# EAGLE design GPS_radiologger_v20 (EAGLE 9.6.2)
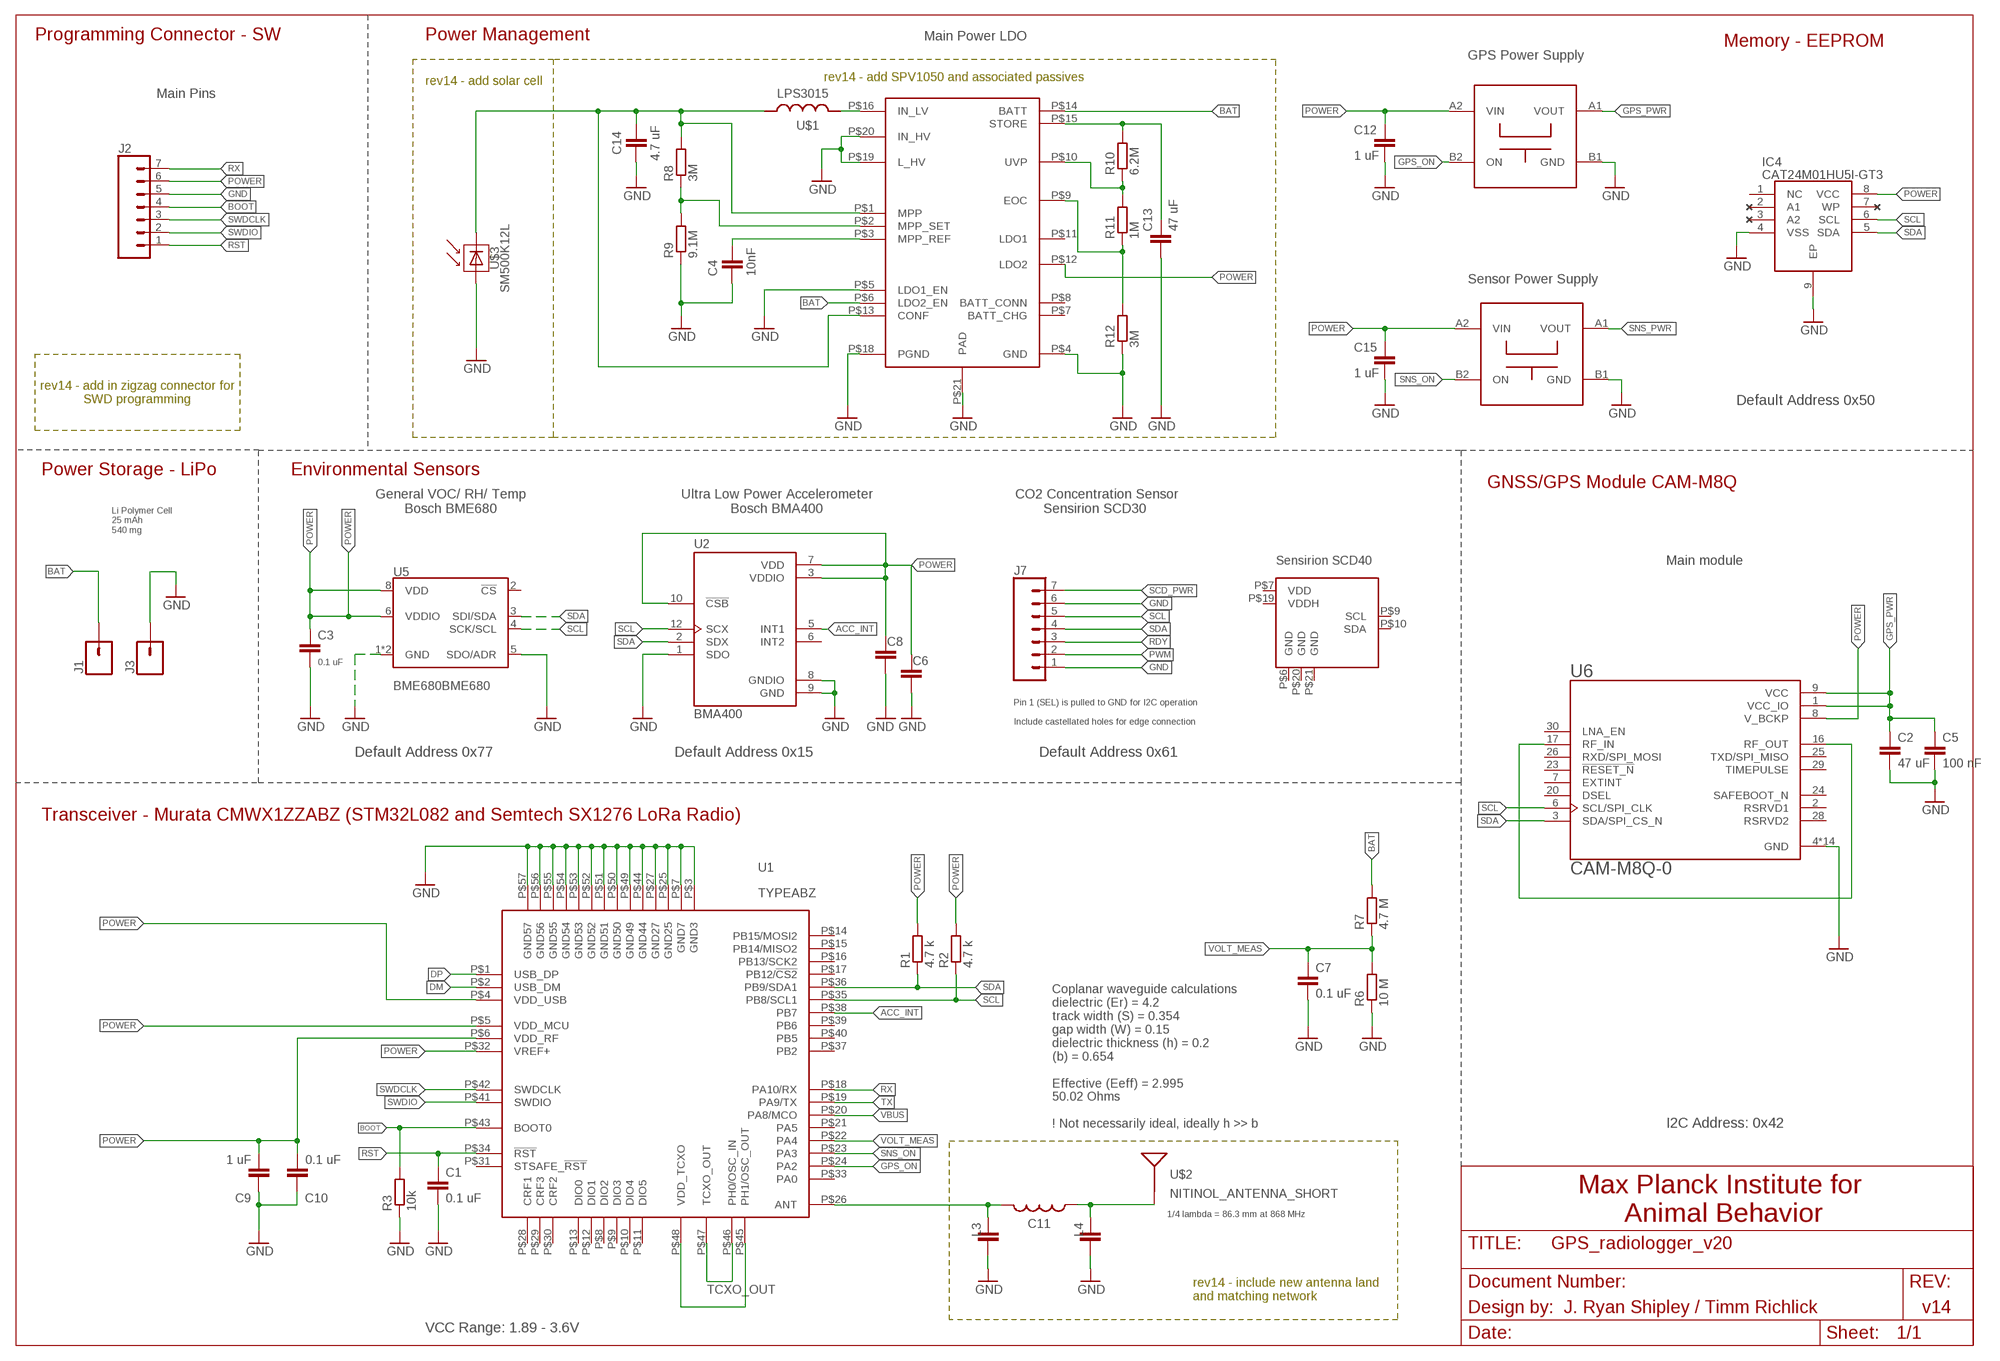
[diagram p0: schematic, sheet 1]

## Parts
C1  0.1 uF  C-EUC0201  [C0201]
C2  47 uF  C-EUC0201  [C0201]
C3  0.1 uF  C-EUC0201  [C0201]
C4  10nF  C-EUC0201  [C0201]
C5  100 nF  C-EUC0201  [C0201]
C6  C-EUC0201  [C0201]
C7  0.1 uF  C-EUC0201  [C0201]
C8  C-EUC0201  [C0201]
C9  1 uF  C-EUC0201  [C0201]
C10  0.1 uF  C-EUC0201  [C0201]
C11  0.1uF  L-USL0201  [L0201]
C12  1 uF  C-EUC0201  [C0201]
C13  47 uF  C-EUC0805K  [C0805K]
C14  4.7 uF  C-EUC0201  [C0201]
C15  1 uF  C-EUC0201  [C0201]
IC4  CAT24M01HU5I-GT3  [SON50P300X200X55-9N]
J1  CONN_01PTH_NO_SILK_YES_STOP  [1X01_NO_SILK]
J2  CONN_07NO_SILK  [1X07_NO_SILK]
J3  CONN_01PTH_NO_SILK_YES_STOP  [1X01_NO_SILK]
J7  CONN_07NO_SILK  [1X07_NO_SILK]
L3  C-EUC0201  [C0201]
L4  C-EUC0201  [C0201]
R1  4.7 k  R-EU_R0201  [R0201]
R2  4.7 k  R-EU_R0201  [R0201]
R3  10k  R-EU_R0201  [R0201]
R6  10 M  R-EU_R0201  [R0201]
R7  4.7 M  R-EU_R0201  [R0201]
R8  3M  R-EU_R0201  [R0201]
R9  9.1M  R-EU_R0201  [R0201]
R10  6.2M  R-EU_R0201  [R0201]
R11  1M  R-EU_R0201  [R0201]
R12  3M  R-EU_R0201  [R0201]
U1  TYPEABZ  [TYPEABZ]
U2  BMA400  [XDCR_BMA400]
U4  SPV1050  [SPV1050]
U5  BME680BME680  [LGA3.0X3.0]
U6  CAM-M8Q-0  [LCC100P960X1400X210-31N]
U$1  LPS3015  [LPS_3015]
U$2  NITINOL_ANTENNA_SHORT  [ICARUS_NITINOL_ANTENNA_SHORT]
U$3  SM500K12L  [SM500K12L]
U$4  TPS22916CL  [YFP0004-DSBGA]
U$5  TPS22916CL  [YFP0004-DSBGA]
U$6  SCD40  [SCD40_LGA]

## Nets
ACC_INT: U1.P$38(PB7) U2.5(INT1)
BAT [battery]: J1.1 R7.2 U4.P$6(LDO2_EN) U4.P$14(BATT)
BOOT: J2.4 R3.2 U1.P$43(BOOT0)
DM: U1.P$2(USB_DM)
DP: U1.P$1(USB_DP)
GND: C1.2 C2.2 C3.2 C4.2 C5.2 C6.2 C7.2 C8.2 C9.1 C10.1 C12.2 C13.2 C14.2 C15.2 IC4.4(VSS) IC4.9(EP) J2.5 J3.1 J7.1 J7.6 L3.2 L4.2 R3.1 R6.1 R9.1 R12.1 U1.P$3(GND3) U1.P$7(GND7) U1.P$25(GND25) U1.P$27(GND27) U1.P$44(GND44) U1.P$49(GND49) U1.P$50(GND50) U1.P$51(GND51) U1.P$52(GND52) U1.P$53(GND53) U1.P$54(GND54) U1.P$55(GND55) U1.P$56(GND56) U1.P$57(GND57) U2.1(SDO) U2.8(GNDIO) U2.9(GND) U4.P$4(GND) U4.P$5(LDO1_EN) U4.P$18(PGND) U4.P$19(L_HV) U4.P$20(IN_HV) U4.P$21(PAD) U5.1(GND) U5.5(SDO/ADR) U5.7(GND) U6.4(GND) U6.5(GND) U6.10(GND) U6.11(GND) U6.12(GND) U6.13(GND) U6.14(GND) U6.15(GND) U6.18(GND) U6.19(GND) U6.21(GND) U6.22(GND) U6.27(GND) U6.31(GND) U$3.P$2(MINUS) U$4.B1(GND) U$5.B1(GND)
GPS_ON: U1.P$24(PA2) U$4.B2(ON)
GPS_PWR: C2.1 C5.1 U6.1(VCC_IO) U6.9(VCC) U$4.A1(VOUT)
N$1: U1.P$45(PH1/OSC_OUT) U1.P$48(VDD_TCXO)
N$2 [antenna]: C11.2 L3.1 U1.P$26(ANT)
N$4: U4.P$16(IN_LV) U$1.P$2
N$6: R8.1 R9.2 U4.P$2(MPP_SET)
N$7 [battery]: C14.1 R8.2 U4.P$1(MPP) U4.P$13(CONF) U$1.P$1 U$3.P$1(PLUS)
N$8: R10.1 R11.2 U4.P$10(UVP)
N$9: R11.1 R12.2 U4.P$9(EOC)
N$11 [antenna]: C11.1 L4.1 U$2.1(SIGNAL) U$2.2(SIGNAL) U$2.3(SIGNAL)
N$12: C13.1 R10.2 U4.P$15(STORE)
N$13: C4.1 U4.P$3(MPP_REF)
N$16: U6.16(RF_OUT) U6.17(RF_IN)
POWER [power]: C3.1 C6.1 C8.1 C9.2 C10.2 C12.1 C15.1 IC4.8(VCC) J2.6 R1.2 R2.2 U1.P$4(VDD_USB) U1.P$5(VDD_MCU) U1.P$6(VDD_RF) U1.P$32(VREF+) U2.3(VDDIO) U2.7(VDD) U2.10(!CSB) U4.P$12(LDO2) U5.6(VDDIO) U5.8(VDD) U6.8(V_BCKP) U$4.A2(VIN) U$5.A2(VIN)
PWM: J7.2
RDY: J7.3
RST: C1.1 J2.1 U1.P$34(!RST)
RX: J2.7 U1.P$18(PA10/RX)
SCD_PWR: J7.7
SCL: IC4.6(SCL) J7.5 R2.1 U1.P$35(PB8/SCL1) U2.12(SCX) U5.4(SCK/SCL) U6.6(SCL/SPI_CLK)
SDA: IC4.5(SDA) J7.4 R1.1 U1.P$36(PB9/SDA1) U2.2(SDX) U5.3(SDI/SDA) U6.3(SDA/SPI_CS_N)
SNS_ON: U1.P$23(PA3) U$5.B2(ON)
SNS_PWR: U$5.A1(VOUT)
SWDCLK: J2.3 U1.P$42(SWDCLK)
SWDIO: J2.2 U1.P$41(SWDIO)
TCXO_OUT: U1.P$46(PH0/OSC_IN) U1.P$47(TCXO_OUT)
TX: U1.P$19(PA9/TX)
VBUS: U1.P$20(PA8/MCO)
VOLT_MEAS: C7.1 R6.2 R7.1 U1.P$22(PA4)
Unconnected: IC4.1(NC) IC4.2(A1) IC4.3(A2) IC4.7(WP) U1.P$8(DIO2) U1.P$9(DIO3) U1.P$10(DIO4) U1.P$11(DIO5) U1.P$12(DIO1) U1.P$13(DIO0) U1.P$14(PB15/MOSI2) U1.P$15(PB14/MISO2) U1.P$16(PB13/SCK2) U1.P$17(PB12/!CS2) U1.P$21(PA5) U1.P$28(CRF1) U1.P$29(CRF3) U1.P$30(CRF2) U1.P$31(STSAFE_!RST) U1.P$33(PA0) U1.P$37(PB2) U1.P$39(PB6) U1.P$40(PB5) U2.6(INT2) U4.P$7(BATT_CHG) U4.P$8(BATT_CONN) U4.P$11(LDO1) U5.2(!CS) U6.2(RSRVD1) U6.7(EXTINT) U6.20(DSEL) U6.23(!RESET_N) U6.24(SAFEBOOT_N) U6.25(TXD/SPI_MISO) U6.26(RXD/SPI_MOSI) U6.28(RSRVD2) U6.29(TIMEPULSE) U6.30(LNA_EN) U$6.P$6(GND) U$6.P$7(VDD) U$6.P$9(SCL) U$6.P$10(SDA) U$6.P$19(VDDH) U$6.P$20(GND) U$6.P$21(GND)

## Notes on the sheet
- Programming Connector - SW | Power Management | Main Power LDO
- Memory - EEPROM
- GPS Power Supply
- rev14 - add SPV1050 and associated passives
- rev14 - add solar cell
- Main Pins
- Sensor Power Supply
- rev14 - add in zigzag connector for
  SWD programming
- Default Address 0x50
- Power Storage - LiPo | Environmental Sensors
- GNSS/GPS Module CAM-M8Q
- General VOC/ RH/ Temp
  Bosch BME680
- Ultra Low Power Accelerometer
  Bosch BMA400
- CO2 Concentration Sensor
  Sensirion SCD30
- Li Polymer Cell
  25 mAh
  540 mg
- Main module
- Pin 1 (SEL) is pulled to GND for I2C operation
- Include castellated holes for edge connection
- Default Address 0x77 | Default Address 0x15 | Default Address 0x61
- Transceiver - Murata CMWX1ZZABZ (STM32L082 and Semtech SX1276 LoRa Radio)
- Coplanar waveguide calculations
  dielectric (Er) = 4.2
  track width (S) = 0.354
  gap width (W) = 0.15
  dielectric thickness (h) = 0.2
  (b) = 0.654
  
  Effective (Eeff) = 2.995
  50.02 Ohms
  
  ! Not necessarily ideal, ideally h >> b
- I2C Address: 0x42
- Max Planck Institute for 
  Animal Behavior
- 1/4 lambda = 86.3 mm at 868 MHz
- rev14 - include new antenna land
  and matching network
- Design by: | J. Ryan Shipley / Timm Richlick | v14
- VCC Range: 1.89 - 3.6V

## Library data of the parts
C1-C10 C12-C15 L3 L4 = rcl:C-EU: CAPACITOR, European symbol; SPICEPREFIX: C
C11 = rcl:L-US: INDUCTOR, American symbol; SPICEPREFIX: L
IC4 = CAT24M01HU5I-GT3-CorrectedV2:CAT24M01HU5I-GT3: EEPROM 1MB I2C SERIAL EEPROM Source: Datasheet <http://www.onsemi.com/pub/Collateral/CAT24M01-D.PDF>; ALLIED_NUMBER: 70300250; ALLIED_PRICE-STOCK: http://www.alliedelec.com/on-semiconductor-cat24m01hu5i-gt3/70300250/; DESCRIPTION: EEPROM 1MB I2C SERIAL EEPROM; HEIGHT: 0.55mm; MANUFACTURER_NAME: ON Semiconductor; MANUFACTURER_PART_NUMBER: CAT24M01HU5I-GT3; MOUSER_PART_NUMBER: 863-CAT24M01HU5I-GT3; MOUSER_PRICE-STOCK: https://www.mouser.com/Search/Refine.aspx?Keyword=863-CAT24M01HU5I-GT3; RS_PART_NUMBER: 7814831P; RS_PRICE-STOCK: http://uk.rs-online.com/web/p/products/7814831P
J1 J3 = SparkFun-Connectors:CONN_01: Single connection point. Often used as Generic Header-pin footprint for 0.1 inch spaced/style header connections On any of the 0.1 inch spaced packages, you can populate with these: Break Away Headers - Straight <https://www.sparkfun.com/products/116> (PRT-00116) Break Away Male Headers - Right Angle <https://www.sparkfun.com/products/553> (PRT-00553) Female Headers <https://www.sparkfun.com/products/115> (PRT-00115) Break Away Headers - Machine Pin <https://www.sparkfun.com/products/117> (PRT-00117) Break Away Female Headers - Swiss Machine Pin <https://www.sparkfun.com/products/743> (PRT-00743) This device is also useful as a general connection point to wire up your design to another part of your project. Our various solder wires solder well into these plated through hole pads. Hook-Up Wire - Assortment (Stranded, 22 AWG) <https://www.sparkfun.com/products/11375> (PRT-11375) Hook-Up Wire - Assortment (Solid Core, 22 AWG) <https://www.sparkfun.com/products/11367> (PRT-11367) View the entire wire category on our website here <https://www.sparkfun.com/categories/141> Special notes: SMTSO-256-ET is a "flush mount" nut for a 4-40 screw. We mostly use this on specialty testbeds; it is a nice way to connect hardware to your PCB at an adjustable hieght. Also note, the SNAP packages are for using a snappable style connector. We sell a baggie of snaps and they are also used on two LilyPad designs: Snap Assortment - 30 pack (male and female) <https://www.sparkfun.com/products/11347> (DEV-11347) LilyPad Arduino SimpleSnap <https://www.sparkfun.com/products/10941> (DEV-10941) LilyPad SimpleSnap Protoboard <https://www.sparkfun.com/products/10940> (DEV-10940)
J2 J7 = SparkFun-Connectors:CONN_07: Multi connection point. Often used as Generic Header-pin footprint for 0.1 inch spaced/style header connections On any of the 0.1 inch spaced packages, you can populate with these: Break Away Headers - Straight <https://www.sparkfun.com/products/116> (PRT-00116) Break Away Male Headers - Right Angle <https://www.sparkfun.com/products/553> (PRT-00553) Female Headers <https://www.sparkfun.com/products/115> (PRT-00115) Break Away Headers - Machine Pin <https://www.sparkfun.com/products/117> (PRT-00117) Break Away Female Headers - Swiss Machine Pin <https://www.sparkfun.com/products/743> (PRT-00743) For SCREWTERMINALS and SPRING TERMINALS visit here: Screw Terimnals on SparkFun.com <https://www.sparkfun.com/search/results?term=Screw+Terminals> (5mm/3.5mm/2.54mm spacing) This device is also useful as a general connection point to wire up your design to another part of your project. Our various solder wires solder well into these plated through hole pads. Hook-Up Wire - Assortment (Stranded, 22 AWG) <https://www.sparkfun.com/products/11375> (PRT-11375) Hook-Up Wire - Assortment (Solid Core, 22 AWG) <https://www.sparkfun.com/products/11367> (PRT-11367) View the entire wire category on our website here <https://www.sparkfun.com/categories/141> Special notes: Molex polarized connector foot print use with SKU : PRT-08231 with associated crimp pins and housings. 1MM SMD Version SKU: PRT-10208 NOTES ON THE VARIANTS LOCK and LOCK_LONGPADS... This footprint was designed to help hold the alignment of a through-hole component (i.e. 6-pin header) while soldering it into place. You may notice that each hole has been shifted either up or down by 0.005 of an inch from it's more standard position (which is a perfectly straight line). This slight alteration caused the pins (the squares in the middle) to touch the edges of the holes. Because they are alternating, it causes a "brace" to hold the component in place. 0.005 has proven to be the perfect amount of "off-center" position when using our standard breakaway headers. Although looks a little odd when you look at the bare footprint, once you have a header in there, the alteration is very hard to notice. Also,if you push a header all the way into place, it is covered up entirely on the bottom side.
R1-R3 R6-R12 = rcl:R-EU_: RESISTOR, European symbol; SPICEPREFIX: R
U1 = Kris:TYPEABZ: CMWX1ZZABZ-078
U2 = BMA400:BMA400: Ultra low power, 12-bit digital triaxial accelerometer; AVAILABILITY: Unavailable; DESCRIPTION: Accelerometer X, Y, Z Axis ±2g, 4g, 8g, 16g 12-LGA (2x2); MF: Bosch Sensortec; MP: BMA400; PACKAGE: LGA-12 Bosch Tools; PRICE: None
U4 = STM-SPV1050_V2:SPV1050
U5 = SparkFun-Sensors:BME680: Bosch BME680 – Combined Humidity and Pressure Sensor The BME680 is as combined digital humidity, pressure and temperature sensor based on proven sensing principles. The sensor module is housed in an extremely compact metal-lid LGA package with a footprint of only 3.0×3.0mm with a height of 0.93mm. Its small dimensions and its low power consumption allow the implementation in battery driven devices such as handsets, GPS modules or watches.; PROD_ID: IC-14656
U6 = CAM-M8Q-0:CAM-M8Q-0: u-blox M8 GNSS Antenna Module*Flash*TCXO; AVAILABILITY: Unavailable; DESCRIPTION: CAM-M8 RF Receiver BeiDou, GLONASS, GNSS, GPS 1.575GHz -167dBm On-Board, Chip Module; MF: U-Blox America; MP: CAM-M8Q-0; PACKAGE: SMD-31 u-blox; PRICE: None
U$1 = coilcraft_custom:LPS3015
U$2 = Antenna_mounts:NITINOL_ANTENNA_SHORT
U$3 = AnySolar:SM500K12L
U$4 U$5 = TPS22916:TPS22916CL
U$6 = Sensirion:SCD40

## Net classes
1 power: width 0.305 mm
2 antenna: width 0.356 mm, clearance 0.178 mm
3 battery: width 0.254 mm

## Board
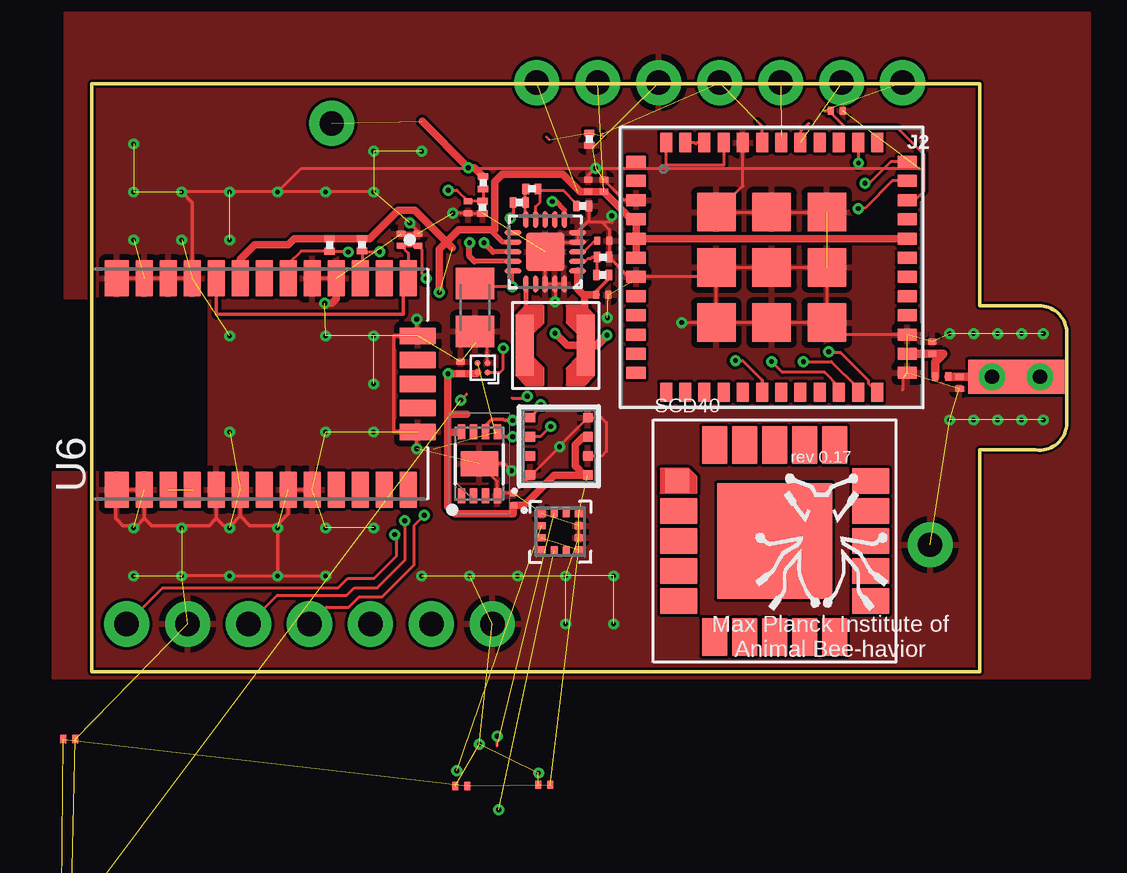
[diagram p1: board, top side]
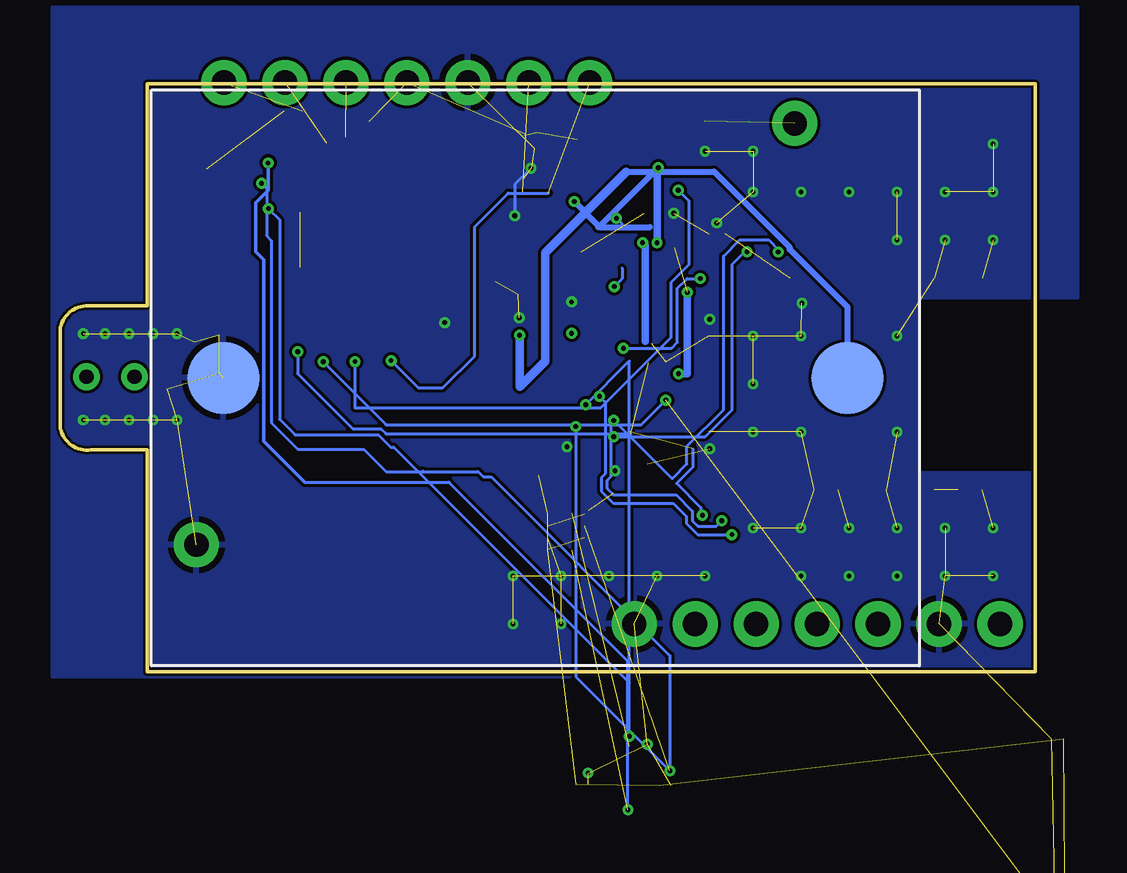
[diagram p2: board, bottom side, seen from below]

Size 40.62 x 24.5 mm. Coordinates in mm from the lower left corner, seen from the top.
Outline: 39.35,9.25 37,9.25 37,0 0,0 0,24.5 37,24.5 37,15.25 39.35,15.25 arc-90 40.62,14.25 40.62,10.25 arc-90 39.35,9.25
Copper layers (1*16): Top 0.035mm / dielectric 0.2mm / Bottom 0.035mm
Design rules "default *": minimum track width 5mil, minimum drill 0.2mm, track to track 5mil, track to pad 5mil, pad to pad 5mil, via to via 5mil, smd to smd 5mil, copper to edge 4mil, drill to drill 4mil, minimum pad ring 10mil, minimum via ring 5mil, stop-mask expansion 0mil, vias tented up to drill 12mil, thermal gap 10mil

### Footprints (pad centres in the part's own frame; a part is rotated, then mirrored left to right if it is on the bottom)
C0201 = smd 0.25 x 0.35: 1 -0.25,0; 2 0.25,0
L0201 = smd 0.25 x 0.35: 1 -0.275,0; 2 0.275,0
C0805K = smd 1.3 x 1.6: 1 -1,0; 2 1,0
SON50P300X200X55-9N = smd 0.63 x 0.32: 1 -1.33,0.75; 2 -1.33,0.25; 3 -1.33,-0.25; 4 -1.33,-0.75; 5 1.33,-0.75; 6 1.33,-0.25; 7 1.33,0.25; 8 1.33,0.75 | smd 1.06 x 1.56: 9 0,0
1X01_NO_SILK = drill 1.016 pad 1.88: 1 0,0
1X07_NO_SILK = drill 1.016 pad 1.88: 1 0,0; 2 2.54,0; 3 5.08,0; 4 7.62,0; 5 10.16,0; 6 12.7,0; 7 15.24,0
R0201 = smd 0.28 x 0.43: 1 -0.255,0; 2 0.255,0
TYPEABZ = smd 0.8 x 0.5: P$1 -5.65,4.4; P$2 -5.65,3.6; P$3 -5.65,2.8; P$4 -5.65,2; P$5 -5.65,1.2; P$6 -5.65,0.4; P$7 -5.65,-0.4; P$8 -5.65,-1.2; P$9 -5.65,-2; P$10 -5.65,-2.8; P$11 -5.65,-3.6; P$12 -5.65,-4.4; P$25 5.65,-4.4; P$26 5.65,-3.6; P$27 5.65,-2.8; P$28 5.65,-2; P$29 5.65,-1.2; P$30 5.65,-0.4; P$31 5.65,0.4; P$32 5.65,1.2; P$33 5.65,2; P$34 5.65,2.8; P$35 5.65,3.6; P$36 5.65,4.4 | smd 0.5 x 0.8: P$13 -4.4,-5.2; P$14 -3.6,-5.2; P$15 -2.8,-5.2; P$16 -2,-5.2; P$17 -1.2,-5.2; P$18 -0.4,-5.2; P$19 0.4,-5.2; P$20 1.2,-5.2; P$21 2,-5.2; P$22 2.8,-5.2; P$23 3.6,-5.2; P$24 4.4,-5.2; P$37 4.4,5.2; P$38 3.6,5.2; P$39 2.8,5.2; P$40 2,5.2; P$41 1.2,5.2; P$42 0.4,5.2; P$43 -0.4,5.2; P$44 -1.2,5.2; P$45 -2,5.2; P$46 -2.8,5.2; P$47 -3.6,5.2; P$48 -4.4,5.2 | smd 1.6 x 1.6: P$49 -2.3,2.3; P$50 0,2.3; P$51 2.3,2.3; P$52 -2.3,0; P$53 0,0; P$54 2.3,0; P$55 -2.3,-2.3; P$56 0,-2.3; P$57 2.3,-2.3
XDCR_BMA400 = smd 0.35 x 0.3: 1 -0.775,0.75; 2 -0.775,0.25; 3 -0.775,-0.25; 4 -0.775,-0.75; 7 0.775,-0.75; 8 0.775,-0.25; 9 0.775,0.25; 10 0.775,0.75 | smd 0.3 x 0.35: 5 -0.25,-0.775; 6 0.25,-0.775; 11 0.25,0.775; 12 -0.25,0.775
SPV1050 = smd 0.7 x 0.2: P$1 -1.35,0.8; P$2 -1.35,0.4; P$3 -1.35,0; P$4 -1.35,-0.4; P$5 -1.35,-0.8; P$11 1.35,-0.8; P$12 1.35,-0.4; P$13 1.35,0; P$14 1.35,0.4; P$15 1.35,0.8 | smd 0.2 x 0.7: P$6 -0.8,-1.35; P$7 -0.4,-1.35; P$8 0,-1.35; P$9 0.4,-1.35; P$10 0.8,-1.35; P$16 0.8,1.35; P$17 0.4,1.35; P$18 0,1.35; P$19 -0.4,1.35; P$20 -0.8,1.35 | smd 1.6 x 1.6: P$21 0,0
LGA3.0X3.0 = smd 0.4 x 0.4: 1 1.2,1.2; 2 1.2,0.4; 3 1.2,-0.4; 4 1.2,-1.2; 5 -1.2,-1.2; 6 -1.2,-0.4; 7 -1.2,0.4; 8 -1.2,1.2
LCC100P960X1400X210-31N = smd 1.5 x 0.7: 1 4.4,-6.2; 2 4.4,-5.2; 3 4.4,-4.2; 4 4.4,-3.2; 5 4.4,-2.2; 6 4.4,-1.2; 7 4.4,-0.2; 8 4.4,0.8; 9 4.4,1.8; 10 4.4,2.8; 11 4.4,3.8; 12 4.4,4.8; 15 -4.4,4.8; 16 -4.4,3.8; 17 -4.4,2.8; 18 -4.4,1.8; 19 -4.4,0.8; 20 -4.4,-0.2; 21 -4.4,-1.2; 22 -4.4,-2.2; 23 -4.4,-3.2; 24 -4.4,-4.2; 25 -4.4,-5.2; 26 -4.4,-6.2 | smd 1.5 x 1: 13 4.4,5.95; 14 -4.4,5.95 | smd 0.7 x 1.5: 27 -2,-6.6; 28 -1,-6.6; 29 0,-6.6; 30 1,-6.6; 31 2,-6.6
LPS_3015 = smd 0.75 x 2.54: P$1 -1.3,0; P$2 1.25,0
ICARUS_NITINOL_ANTENNA_SHORT = smd 4 x 1.4: 1 0,0 | drill 0.6: 2 -1,0; 3 1,0
SM500K12L = smd 3 x 3: P$1 0,13; P$2 0,-13
YFP0004-DSBGA = smd 0.25 x 0.25: A1 0.2,-0.2; A2 -0.2,-0.2; B1 0.2,0.2; B2 -0.2,0.2
SCD40_LGA = smd 1 x 1: P$1 -4.05,2.5 | smd 1.55 x 1.05: P$2 -4,1.25; P$3 -4,0; P$4 -4,-1.25; P$5 -4,-2.5; P$11 4,-2.5; P$12 4,-1.25; P$13 4,0; P$14 4,1.25; P$15 4,2.5 | smd 1.05 x 1.55: P$6 -2.5,-4; P$7 -1.25,-4; P$8 0,-4; P$9 1.25,-4; P$10 2.5,-4; P$16 2.5,4; P$17 1.25,4; P$18 0,4; P$19 -1.25,4; P$20 -2.5,4 | smd 4.8 x 4.8: P$21 0,0

### Placement (x,y rotation side)
C1  31.04,23.39 0 top
C2  13.6,18 90 top
C3  17.57,7.2 90 top
C4  21.32,17.97 0 top
C5  12.9,18 90 top
C6  15.4,-4.75 180 top  (outside the outline)
C7  15.69,19.36 270 top
C8  18.86,-4.7 180 top  (outside the outline)
C9  20.7,20.25 270 top
C10  21.35,20.25 270 top
C11  35.43,12.31 180 top
C12  -0.94,-2.8 0 top
C13  15.98,15.19 270 top
C14  21.28,15.72 0 top
C15  15.38,12.68 90 top
IC4  16.16,8.68 90 top
J1  10.01,22.86 0 top
J2  33.79,24.56 180 top
J3  34.94,5.3 0 top
J7  16.7,2 180 top
L3  35.03,13.52 90 top
L4  36.16,12.06 270 top
R1  11.27,17.8 90 top
R2  9.92,17.79 90 top
R3  20.73,22.2 90 top
R6  16.29,19.36 90 top
R7  16.32,20.39 90 top
R8  21.3,16.54 0 top
R9  21.31,17.29 180 top
R10  17.82,19.56 180 top
R11  18.35,20.13 180 top
R12  20.46,19.42 180 top
U1  28.34,16.86 0 top
U2  19.53,5.84 0 top
U4  18.9,17.51 180 top
U5  19.48,9.4 180 top
U6  7,12 90 top
U$1  19.29,13.61 180 top
U$2  38.52,12.3 0 top
U$3  20.82,12.25 270 bottom
U$4  16.29,12.68 0 top
U$5  -1.07,-11.11 0 top  (outside the outline)
U$6  28.46,5.46 0 top

### Tracks (layer width: path | path; a pad name or v marks a point on that pad's centre or on a via)
ACC_INT  (via drill 0.2)  (1 unrouted)
  Top 0.127: v31.95,21.21 31.94,21.23 U1.P$38
  Bottom 0.127: v31.95,21.21 32.03,21.13 | 30.44,7.91 24.43,7.91 16.96,0.45 v16.96,-5.74
  Bottom 0.152: 30.44,7.91 32.14,9.62 32.14,17.17 32.48,17.5 32.48,19.56 31.95,20.08 v31.95,21.21
BAT  (via drill 0.2)  (1 unrouted)
  Top 0.2: U4.P$14 15.95,17.11
  Top 0.203: v19.2,19.61 19.36,19.61 19.7,19.26 U4.P$6
  Top 0.254: 15.95,17.11 15.74,17.32 15.74,17.91 15.75,17.91 v15.75,17.89
  Top 0.305: 13.78,22.94 v15.7,21.02 15.94,21.02 R7.2
  Bottom 0.254: v15.7,21.02 18.18,18.54 18.2,18.54 | v19.2,19.61 18.13,18.54 16.04,18.54
  Bottom 0.305: v15.75,17.89 15.75,20.96 v15.7,21.02
BOOT  (4 unrouted)
  Top 0.127: 27.74,22.06 U1.P$43 27.94,22.74 27.74,22.94 | 21.28,22.35 21.28,22.42 | 19.07,22.18 18.95,22.3
DM
  Top 0.127: U1.P$2 22.66,20.48
GND  (via drill 0.2)  (69 unrouted)
  Top 0.127: C4.2 21.63,17.97 | 22.49,16.26 U1.P$7 25.64,16.46 U1.P$52 | C4.2 R9.1 | U4.P$20 U4.P$19 | U4.P$19 U4.P$18 U4.P$21 19.27,17.88 | R12.1 20.71,18.82 20.25,18.36 U4.P$5 | 19.3,17.91 19.27,17.88 | U4.P$5 20.68,18.73 21.27,18.73 | 21.27,18.73 21.68,18.73 v21.68,19.02 | 21.27,18.73 21.57,18.43 C4.2 | C5.2 C2.2 13.63,18.22 | 20.68,9.06 U5.7 21.25,8.99 21.45,9.19 21.45,10.39 21.24,10.6 U5.5 19.5,9.42 v19.5,9.39 18.31,8.2 U5.1 18.28,8.16 C3.2 17.02,7.45 IC4.4 16.91,7.93 IC4.9 | U1.P$51 U1.P$50 U1.P$49 27.14,20.26 U1.P$44 27.14,22.43 | U1.P$52 U1.P$53 U1.P$54 U1.P$57 | U1.P$57 U1.P$56 U1.P$55 | U1.P$55 U1.P$52 | 16.29,8.55 IC4.9 | C10.1 22.2,19.66 U1.P$3 | v3.75,4 v5.75,4 v7.75,4 v9.75,4 | R6.1 C7.2 v15.06,19.11 v15.05,19.11 | R3.1 20.87,21.82 | 19.27,17.88 20.21,17.88 U4.P$4 U4.P$5 | v21.5,14.77 v21.5,14.76 | 15.98,13.71 C13.2 16.49,13.68 U$4.B1 | U1.P$25 | 33.79,11.76 33.79,12.46 U1.P$25 | U1.P$55 v24.59,14.56 | v17.5,8.39 17.21,8.68 IC4.9 | v13.55,9.3 13.55,9.95 13.5,10 | U1.P$27 31.14,14.06 U1.P$57 | v11.75,20 v9.75,20 v7.75,20 | v7.75,20 v5.75,20 v3.75,20 | 34.51,20.96 8.71,20.96 v7.75,20 | 34.01,12.46 U1.P$25 | U4.P$19 v19.31,15.42 | U2.8 U2.9 | C6.2 15.05,-4.75 | v18.61,-4.21 v18.62,-4.21 | U2.1 18.6,6.75
  Top 0.152: U6.27 13.5,10 12.6,10 12.6,14 U6.31 13.55,14 v13.55,14.7 | U6.22 U6.21 8.2,6.6 7.7,6.1 | 7.7,6.1 6.6,6.1 6.2,6.5 | 6.2,6.5 U6.19 | 6.2,6.5 5.8,6.1 5.5,6.1 5.2,6.4 | 5.2,6.4 U6.18 | 5.2,6.4 4.9,6.1 2.5,6.1 2.2,6.4 | 2.2,6.4 U6.15 U6.14 1,7.55 1,6.4 1.3,6.1 1.9,6.1 2.2,6.4 | U6.13 U6.12 U6.11 U6.10 4.2,19.55 v3.75,20 | U6.4 U6.5 | 21.64,17.36 R9.1 22.54,16.31 U1.P$7 | 7.7,6.1 7.75,6.05 v7.75,4 | C2.2 13.6,18.37 v13.26,18.71 | C9.1 20.7,20.69 v21,20.99
  Top 0.305: U6.4 10.2,15.56 10,15.36 v9.71,15.36
  Bottom 0.127: v21,20.99 21.68,20.32 v21.68,19.02
  other vias: 36.75,10.5 38.75,10.5 36.75,14.1 38.75,14.1 37.75,14.1 35.75,14.1 37.75,10.5 35.75,10.5 16.16,-3 1.75,20 3.75,18 1.75,18 1.75,22 3.75,6 5.75,6 1.75,4 1.75,6 7.75,6 5.75,14 5.75,10 9.75,10 11.75,10 11.75,12 9.75,14 11.75,14 9.75,6 11.75,6 5.75,18 13.75,4 15.75,4 17.75,4 19.75,4 21.75,4 39.65,14.1 39.65,10.5 13.75,21.7 11.75,21.7 19.75,2 21.75,2
  pour Top: -1.1,27.45 41.57,27.45 41.57,-0.25 -1.6,-0.25 -1.6,8.3 4.9,8.3 4.9,15.6 -1.1,15.6
  pour Bottom: -1.79,27.7 40.94,27.7 40.94,-0.2 -0.4,-0.2 -0.4,8.3 4.9,8.3 4.9,15.6 -1.79,15.6
GPS_ON  (via drill 0.2)  (1 unrouted)
  Top 0.127: U1.P$24 32.38,12.02 32.38,12.14 31.22,13.3 30.75,13.3 30.72,13.33 v30.72,13.35
  Bottom 0.127: v30.72,13.35 30.72,12.43 28.42,10.13 27.25,10.13 27.04,9.92 16.84,9.92
GPS_PWR  (via drill 0.2)
  Top 0.127: C5.1 13.2,17.45 U6.1 | C2.1 13.75,17.6 13.75,16.59 v13.95,16.39 | U$4.A1 16.99,12.48 17,12.47 17.15,12.62 v17.15,13.49
  Top 0.152: U6.9 5.2,14.9 12.98,14.9 12.98,16.18 U6.1 | C2.1 C5.1
  Bottom 0.127: v17.15,13.49 15.14,13.49 14.9,13.73 14.9,15.99 14.49,16.39 v13.95,16.39
N$1
  Top 0.127: U1.P$45 26.34,21.11 23.94,21.11 U1.P$48
N$2
  Top 0.356: C11.2 35.15,12.93 35.49,13.27 L3.1 U1.P$26
N$4
  Top 0.203: U4.P$16 18.1,13.66 U$1.P$2
N$6
  Top 0.127: R8.1 21.04,17.27 R9.2 20.86,17.29 20.79,17.21 20.67,17.21 20.57,17.11 U4.P$2
N$7  (via drill 0.2)
  Top 0.15: C14.1 21.03,15.87 21.55,16.39 R8.2
  Top 0.2: U4.P$13 16.73,17.51
  Top 0.254: 16.73,17.51 v16.35,17.89
  Top 0.305: v19.31,14.12 19.82,13.61 U$1.P$1 20.54,13.65 20.54,15.66 | U4.P$1 20.25,15.95 20.54,15.66 | 20.54,15.66 20.6,15.72 C14.1
  Top 0.356: v21.48,14.03 21.05,13.61 U$1.P$1
  Bottom 0.254: 17.02,20.85 13.37,20.85 10.22,17.7 10.22,17.61 7.82,15.21 U$3.P$1
  Bottom 0.305: v16.35,17.89 16.25,17.79 16.25,13.78
  Bottom 0.356: v21.48,14.03 21.48,11.88 20.4,12.95 20.4,17.48 17.02,20.85
N$8
  Top 0.127: U4.P$10 18.07,18.89 R10.1 18.07,20.11 R11.2
N$9
  Top 0.127: R12.2 20.2,19.52 19.68,20.05 18.68,20.05 | R11.1 18.68,20.05 | U4.P$9 18.5,19.39 18.68,19.57 18.68,20.05
N$11
  Top 0.356: U$2.3 U$2.1 U$2.2 L4.1 C11.1
N$12  (via drill 0.2)
  Top 0.127: U4.P$15 17.53,16.69 v17.53,16.06 16.11,16.06 C13.1 | R10.2 17.57,19.04 v17.44,18.91
  Bottom 0.127: v17.53,16.06 17.2,16.39 17.2,16.83 | 17.2,18.67 v17.44,18.91
N$13
  Top 0.127: U4.P$3 20.27,17.49 20.49,17.49 20.97,17.97 C4.1
N$16  (1 unrouted)
POWER  (via drill 0.2)  (9 unrouted)
  Top 0.2: U4.P$12 17.13,17.91 16.61,18.43
  Top 0.305: U6.8 6.2,17.2 6.8,17.8 8.21,17.8 8.45,18.05 R2.2 R1.2 11.6,18.05 12.78,19.24 13.46,19.24 15.03,17.67 | U1.P$5 U1.P$4 22.65,18.82 22.53,18.82 C10.2 C9.2 20.35,20 19.62,20.73 17.12,20.73 | U1.P$5 U1.P$6 | 17.12,20.73 16.81,20.43 16.81,18.43 16.61,18.43 15.29,18.43 14.48,17.62 v14.48,15.81 | 14.85,9.99 15.39,9.99 IC4.8 | 14.85,10.74 v14.85,12.43 C15.1 16.04,12.43 U$4.A2 | U5.6 20.48,9.8 20.15,9.47 20.15,8.59 20.54,8.2 U5.8 19.28,8.2 18.03,6.95 C3.1 17.57,6.59 15.15,6.59 14.85,6.89 14.85,9.99 | U1.P$32 U1.P$5 | 14.85,10.74 14.85,9.99 | 15.63,10.74 14.85,10.74 | 17.12,20.74 17.12,20.73
  Bottom 0.305: v14.48,15.81 14.48,12.43 v14.85,12.43
RST  (1 unrouted)
  Top 0.127: U1.P$34 34.29,19.66 34.69,20.06 34.69,21.56 33.58,22.67 31.41,22.67 30.79,23.29 C1.1 30.53,23.39
RX  (via drill 0.2)  (1 unrouted)
  Top 0.127: 27.94,12.16 27.12,12.97 v26.83,12.97
  Top 0.152: 27.94,12.16 U1.P$18
  Bottom 0.127: v26.83,12.97 25.7,11.85 24.67,11.85 23.35,13.16 23.35,18.55 21.95,19.95 20.27,19.95
SCD_PWR  (via drill 0.2)
  Top 0.127: 17.52,11.41 18.07,11.41 v18.15,11.49 | J7.7 2.96,3.5 10.28,3.5 10.68,3.9 11.78,3.9 12.7,4.83 12.7,5.65 v12.63,5.72
  Bottom 0.127: v18.15,11.49 17.9,11.24 17.9,8.26 18.07,8.09 18.07,7.53 17.56,7.03 15.07,7.03 14.53,6.48 14.53,6.2 14.06,5.72 v12.63,5.72
SCL  (via drill 0.2)  (1 unrouted)
  Top 0.127: U1.P$35 33.37,20.46 32.24,19.33 31.96,19.33 v31.94,19.31 | 18.26,10.58 U5.4 18.72,11.04 v18.72,11.14 | 16.41,10.18 IC4.6 | 8.2,17 8.73,17.54 R2.1 10.77,17.54 10.8,17.5 v10.7,17.5 | U2.12 19.28,6.66 | 16.9,-3.09 v16.9,-2.67 | J7.5 7.74,3.2 10.64,3.2 10.95,3.51 11.9,3.51 13.05,4.65 13.05,6.07 | v13.05,6.3 13.05,6.07 | 13.05,6.07
  Top 0.152: U6.6 8.2,17 | 16.41,10.18 16.41,10.27 16.67,10.53 17.16,10.53 17.2,10.48 v17.55,10.48 17.65,10.58 18.26,10.58
  Bottom 0.127: v10.7,17.5 10.7,17.6 11.1,18 12.3,18 12.98,17.32 12.98,10.93 14.5,9.4 14.5,8.68 15.1,8.07 15.14,8.07 v17.55,10.48 17.65,10.39 17.65,8.16 17.82,7.99 17.82,7.64 17.55,7.38 14.95,7.38 14.28,6.7 14.28,6.3 14.05,6.08 13.28,6.08 v13.05,6.3 | v31.94,19.31 31.48,18.84 31.48,10.53 30.82,9.88 27.36,9.88 26.85,9.37 26.73,9.37 16.9,-0.46 v16.9,-2.67 16.9,12.96 v18.72,11.14
SDA  (via drill 0.2)  (2 unrouted)
  Top 0.127: U1.P$36 33.3,21.26 32.4,20.36 v32.23,20.36 | U6.3 11.27,16.47 R1.1 11.31,17.5 v12,17.5 | 17.65,9.8 17.75,9.7 18.18,9.7 U5.3 18.7,9.8 v19.13,10.23 | J7.4 9.78,2.7 10.72,2.7 11.15,3.13 12.11,3.13 13.43,4.45 13.43,6.09 v13.86,6.53
  Top 0.152: 17.65,9.8 v17.55,9.8 17.12,9.8 IC4.5
  Bottom 0.127: v12,17.5 12.1,17.5 12.63,16.97 12.63,10.91 13.75,9.8 v17.55,9.8 | 25.5,8.37 25.52,8.34 | 25.52,8.34 27.04,8.34 27.96,9.27 30.69,9.27 31.82,10.39 31.82,17.98 32.02,18.18 32.02,20.15 v32.23,20.36 32.34,20.24 | 14.25,9.3 14.25,8.55 14.94,7.86 13.93,6.85 13.93,6.53 v13.86,6.53 | 25.52,8.34 23.2,8.34 22.98,8.13 22.66,8.13 15.21,0.68 v15.21,-4.11 19.13,-0.19 v19.13,10.23
SNS_ON  (via drill 0.2)  (1 unrouted)
  Top 0.127: v29.66,12.93 30.83,12.93 31.94,11.82 U1.P$23 | 15.62,11.57 v15.38,11.33
  Bottom 0.127: v29.66,12.93 27.03,10.3 16.41,10.3 v15.38,11.33
SWDCLK  (1 unrouted)
  Top 0.127: U1.P$42 28.74,22.29
SWDIO  (1 unrouted)
  Top 0.127: 29.89,22.86 29.54,22.51 U1.P$41
TCXO_OUT
  Top 0.127: U1.P$46 25.24,22.06 25.18,22 25.12,22.06 U1.P$47
VOLT_MEAS  (via drill 0.2)
  Top 0.127: R7.1 16.32,19.64 R6.2 C7.1 15.22,20.07 v14.87,20.07 | U1.P$22 31.14,11.89 30.54,12.48 28.79,12.48 v28.34,12.94
  Bottom 0.127: v28.34,12.94 28.34,11.01 18.1,11.01 15.16,13.94 15.16,16.23 14.42,16.97 14.42,19.63 v14.87,20.07

### Text on the board
tPlace: rev 0.17 | Max Planck Institute of / Animal Bee-havior
tValues: - | +